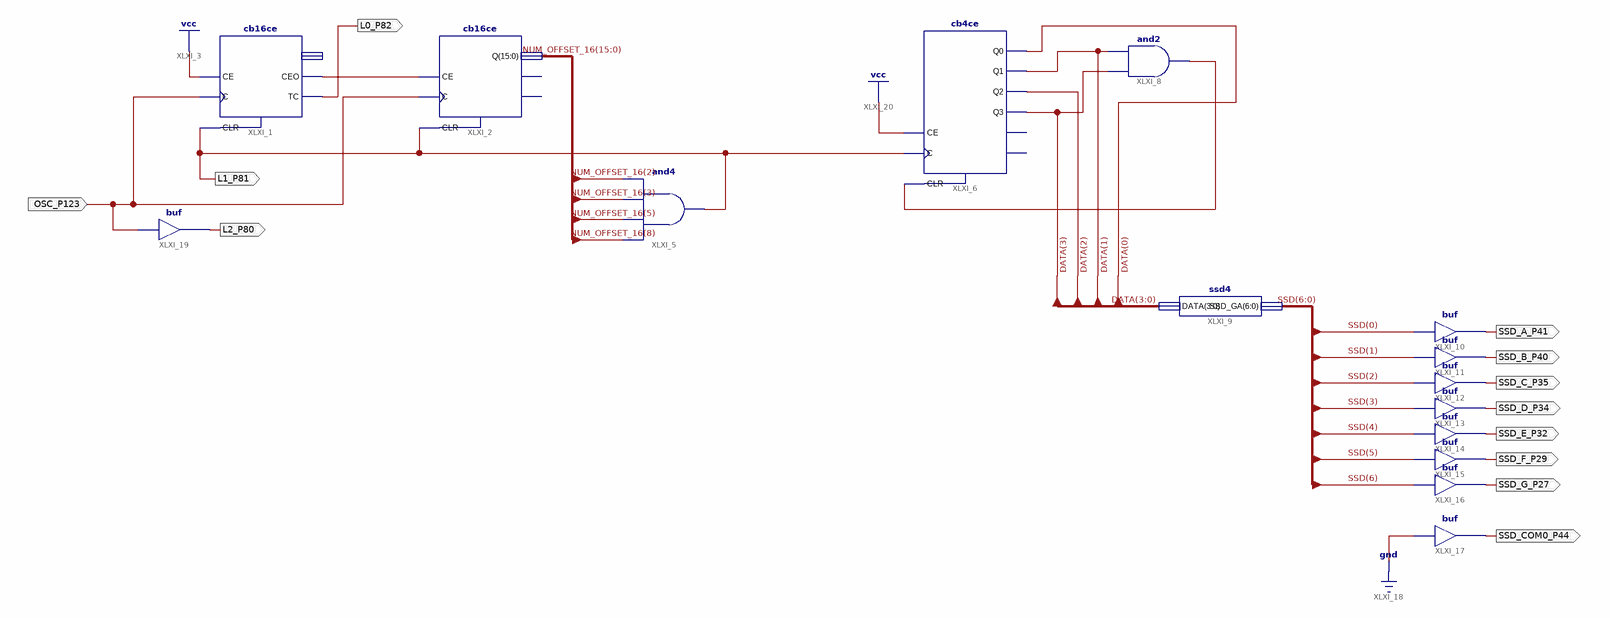
[diagram p0: schematic sheet 1]
// Xilinx ISE schematic integration.sch (spartan6) as structural Verilog: 15 symbols, 12 ports
module integration (
  input  OSC_P123,
  output L1_P81,
  output SSD_A_P41,
  output SSD_B_P40,
  output SSD_C_P35,
  output SSD_D_P34,
  output SSD_E_P32,
  output SSD_F_P29,
  output SSD_G_P27,
  output SSD_COM0_P44,
  output L0_P82,
  output L2_P80
);

  wire XLXN_4, XLXN_17;
  wire [3:0] DATA;
  wire [6:0] SSD;
  wire [15:0] NUM_OFFSET_16;

  cb16ce XLXI_1 (.C(OSC_P123), .CE(1'b1), .CLR(L1_P81), .CEO(XLXN_4), .TC(L0_P82));  // open: Q
  cb16ce XLXI_2 (.C(OSC_P123), .CE(XLXN_4), .CLR(L1_P81), .Q(NUM_OFFSET_16));  // open: CEO, TC
  and XLXI_5 (L1_P81, NUM_OFFSET_16[8], NUM_OFFSET_16[5], NUM_OFFSET_16[3], NUM_OFFSET_16[2]);
  cb4ce XLXI_6 (
    .C(L1_P81), .CE(1'b1), .CLR(XLXN_17), .Q0(DATA[0]), .Q1(DATA[1]), .Q2(DATA[2]), .Q3(DATA[3]));  // open: CEO, TC
  and XLXI_8 (XLXN_17, DATA[3], DATA[1]);
  ssd4 XLXI_9 (.DATA(DATA), .SSD_GA(SSD));
  buf XLXI_10 (SSD_A_P41, SSD[0]);
  buf XLXI_11 (SSD_B_P40, SSD[1]);
  buf XLXI_12 (SSD_C_P35, SSD[2]);
  buf XLXI_13 (SSD_D_P34, SSD[3]);
  buf XLXI_14 (SSD_E_P32, SSD[4]);
  buf XLXI_15 (SSD_F_P29, SSD[5]);
  buf XLXI_16 (SSD_G_P27, SSD[6]);
  buf XLXI_17 (SSD_COM0_P44, 1'b0);
  buf XLXI_19 (L2_P80, OSC_P123);
endmodule
